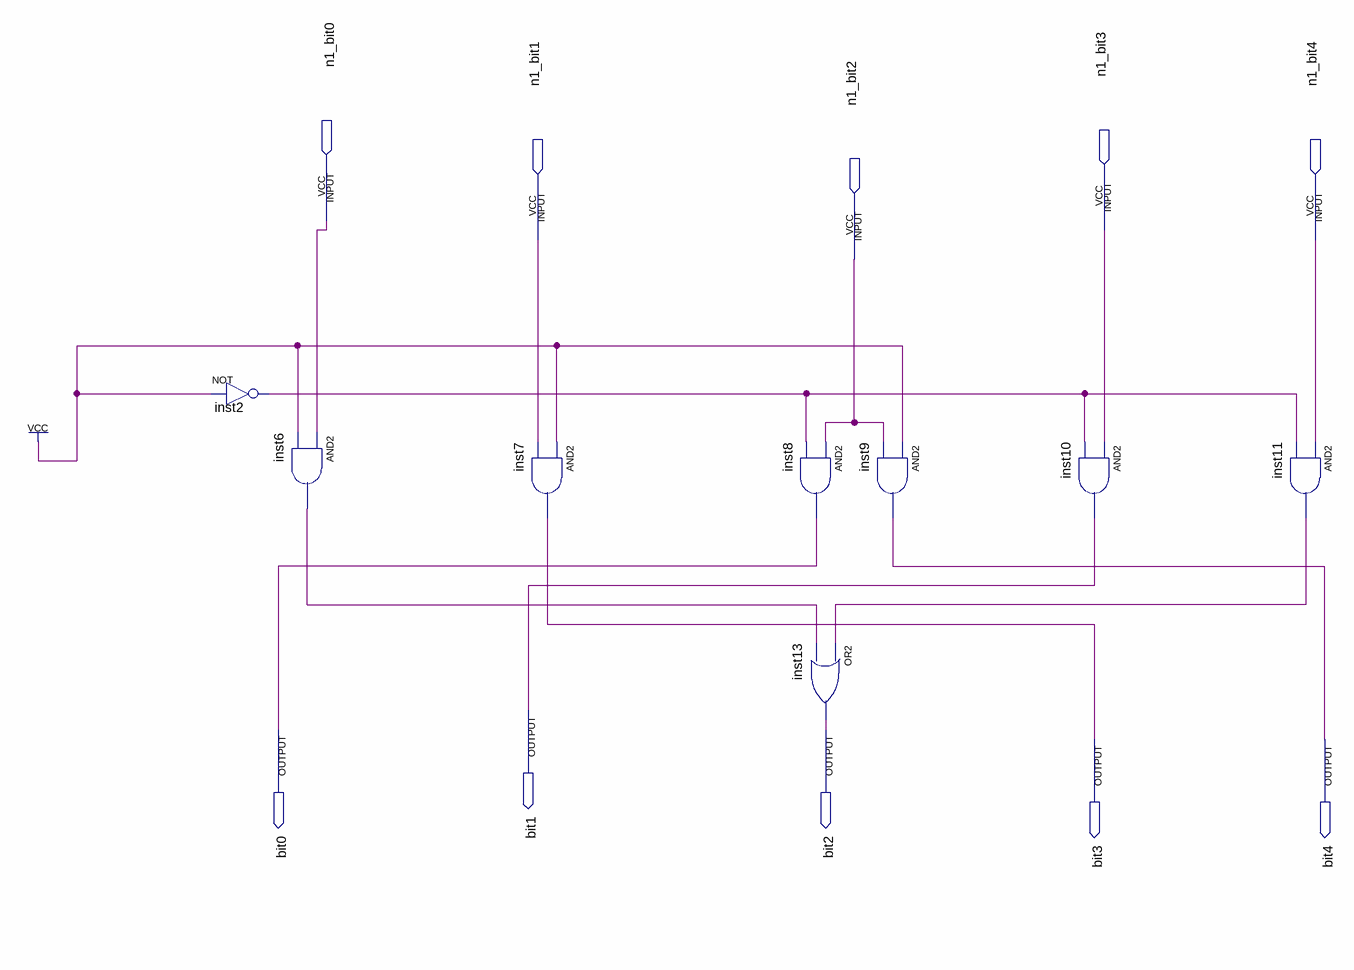
[diagram p0: schematic sheet]
// Quartus schematic shiftbit_2.bdf as structural Verilog: 8 symbols, 10 pins
module shiftbit_2 (
  input  n1_bit0,
  input  n1_bit3,
  input  n1_bit1,
  input  n1_bit4,
  input  n1_bit2,
  output bit1,
  output bit0,
  output bit2,
  output bit3,
  output bit4
);

  wire inst2_out, inst6_out, inst11_out;

  not inst2 (inst2_out, 1'b1);
  and inst6 (inst6_out, n1_bit0, 1'b1);
  and inst7 (bit3, 1'b1, n1_bit1);
  and inst8 (bit0, n1_bit2, inst2_out);
  and inst9 (bit4, 1'b1, n1_bit2);
  or inst13 (bit2, inst11_out, inst6_out);
  and inst10 (bit1, n1_bit3, inst2_out);
  and inst11 (inst11_out, n1_bit4, inst2_out);
endmodule
